# EAGLE design Insight (EAGLE 9.6.2)
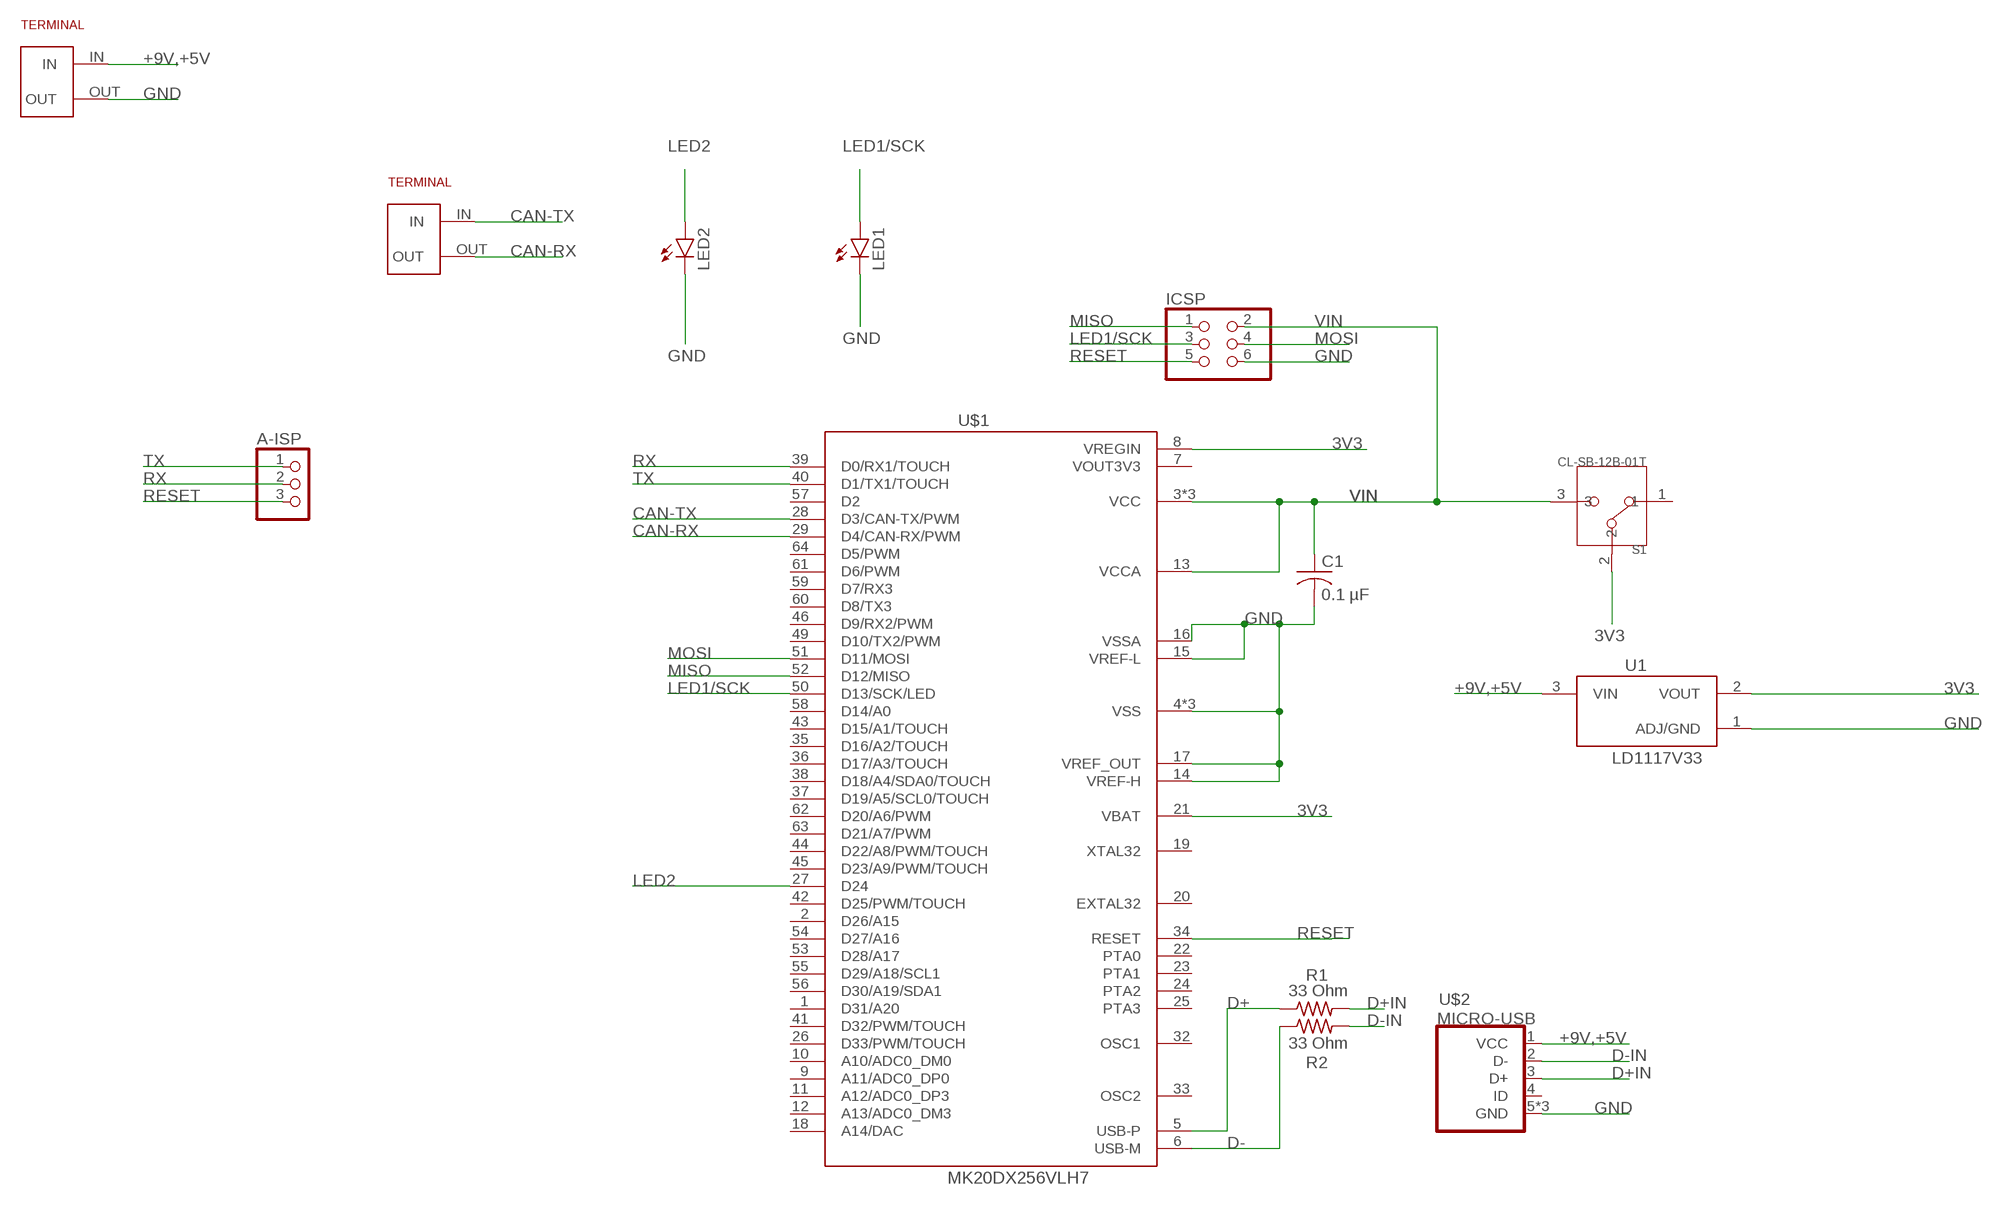
[diagram p0: schematic, sheet 1]

## Parts
A-ISP  PINHD-1X3  [1X03]
C1  0.1 µF  C-USC0805  [C0805]
ICSP  PINHD-2X3  [2X03]
LED1  LED5MM  [LED5MM]
LED2  LED5MM  [LED5MM]
R1  33 Ohm  R-US_R1206  [R1206]
R2  33 Ohm  R-US_R1206  [R1206]
S1  CL-SB-12B-01T  [CL-SB-12B]
U1  LD1117V33  [TO255P1020X450X1968-3]
U$1  MK20DX256VLH7  [QFP50P1200X1200X160-64N]
U$2  MICRO-USB  [MICRO-USB]
U$3  SCREWTERMINAL  [SCREWTERMINAL]
U$4  SCREWTERMINAL  [SCREWTERMINAL]

## Nets
3V3: S1.2 U1.2(VOUT) U$1.8(VREGIN) U$1.21(VBAT)
+9V,+5V: U1.3(VIN) U$2.1(VCC) U$3.IN
CAN-RX: U$1.29(D4/CAN-RX/PWM) U$4.OUT
CAN-TX: U$1.28(D3/CAN-TX/PWM) U$4.IN
D+: R1.1 U$1.5(USB-P)
D+IN: R1.2 U$2.3(D+)
D-: R2.1 U$1.6(USB-M)
D-IN: R2.2 U$2.2(D-)
GND: C1.2 ICSP.6 LED1.K(C) LED2.K(C) U1.1(ADJ/GND) U$1.4(VSS) U$1.14(VREF-H) U$1.15(VREF-L) U$1.16(VSSA) U$1.17(VREF_OUT) U$1.31(VSS) U$1.47(VSS) U$2.5(GND) U$2.GND1(GND) U$2.GND2(GND) U$3.OUT
LED1/SCK: ICSP.3 LED1.A U$1.50(D13/SCK/LED)
LED2: LED2.A U$1.27(D24)
MISO: ICSP.1 U$1.52(D12/MISO)
MOSI: ICSP.4 U$1.51(D11/MOSI)
RESET: A-ISP.3 ICSP.5 U$1.34(RESET)
RX: A-ISP.2 U$1.39(D0/RX1/TOUCH)
TX: A-ISP.1 U$1.40(D1/TX1/TOUCH)
VIN: C1.1 ICSP.2 S1.3 U$1.3(VCC) U$1.13(VCCA) U$1.30(VCC) U$1.48(VCC)
Unconnected: S1.1 U$1.1(D31/A20) U$1.2(D26/A15) U$1.7(VOUT3V3) U$1.9(A11/ADC0_DP0) U$1.10(A10/ADC0_DM0) U$1.11(A12/ADC0_DP3) U$1.12(A13/ADC0_DM3) U$1.18(A14/DAC) U$1.19(XTAL32) U$1.20(EXTAL32) U$1.22(PTA0) U$1.23(PTA1) U$1.24(PTA2) U$1.25(PTA3) U$1.26(D33/PWM/TOUCH) U$1.32(OSC1) U$1.33(OSC2) U$1.35(D16/A2/TOUCH) U$1.36(D17/A3/TOUCH) U$1.37(D19/A5/SCL0/TOUCH) U$1.38(D18/A4/SDA0/TOUCH) U$1.41(D32/PWM/TOUCH) U$1.42(D25/PWM/TOUCH) U$1.43(D15/A1/TOUCH) U$1.44(D22/A8/PWM/TOUCH) U$1.45(D23/A9/PWM/TOUCH) U$1.46(D9/RX2/PWM) U$1.49(D10/TX2/PWM) U$1.53(D28/A17) U$1.54(D27/A16) U$1.55(D29/A18/SCL1) U$1.56(D30/A19/SDA1) U$1.57(D2) U$1.58(D14/A0) U$1.59(D7/RX3) U$1.60(D8/TX3) U$1.61(D6/PWM) U$1.62(D20/A6/PWM) U$1.63(D21/A7/PWM) U$1.64(D5/PWM) U$2.4(ID)

## Library data of the parts
A-ISP = pinhead:PINHD-1X3: PIN HEADER
C1 = rcl:C-US: CAPACITOR, American symbol; SPICEPREFIX: C
ICSP = pinhead:PINHD-2X3: PIN HEADER
LED1 LED2 = led:LED: LED OSRAM: - CHIPLED LG R971, LG N971, LY N971, LG Q971, LY Q971, LO R971, LY R971 LH N974, LH R974 LS Q976, LO Q976, LY Q976 LO Q996 - Hyper CHIPLED LW Q18S LB Q993, LB Q99A, LB R99A - SideLED LS A670, LO A670, LY A670, LG A670, LP A670 LB A673, LV A673, LT A673, LW A673 LH A674 LY A675 LS A676, LA A676, LO A676, LY A676, LW A676 LS A679, LY A679, LG A679 - Hyper Micro SIDELED® LS Y876, LA Y876, LO Y876, LY Y876 LT Y87S - SmartLED LW L88C, LW L88S LB L89C, LB L89S, LG L890 LS L89K, LO L89K, LY L89K LS L896, LA L896, LO L896, LY L896 - TOPLED LS T670, LO T670, LY T670, LG T670, LP T670 LSG T670, LSP T670, LSY T670, LOP T670, LYG T670 LG T671, LOG T671, LSG T671 LB T673, LV T673, LT T673, LW T673 LH T674 LS T676, LA T676, LO T676, LY T676, LB T676, LH T676, LSB T676, LW T676 LB T67C, LV T67C, LT T67C, LS T67K, LO T67K, LY T67K, LW E67C LS E67B, LA E67B, LO E67B, LY E67B, LB E67C, LV E67C, LT E67C LW T67C LS T679, LY T679, LG T679 LS T770, LO T770, LY T770, LG T770, LP T770 LB T773, LV T773, LT T773, LW T773 LH T774 LS E675, LA E675, LY E675, LS T675 LS T776, LA T776, LO T776, LY T776, LB T776 LHGB T686 LT T68C, LB T68C - Hyper Mini TOPLED® LB M676 - Mini TOPLED Santana® LG M470 LS M47K, LO M47K, LY M47K Source: http://www.osram.convergy.de LUXEON: - LUMILED® LXK2-PW12-R00, LXK2-PW12-S00, LXK2-PW14-U00, LXK2-PW14-V00 LXK2-PM12-R00, LXK2-PM12-S00, LXK2-PM14-U00 LXK2-PE12-Q00, LXK2-PE12-R00, LXK2-PE12-S00, LXK2-PE14-T00, LXK2-PE14-U00 LXK2-PB12-K00, LXK2-PB12-L00, LXK2-PB12-M00, LXK2-PB14-N00, LXK2-PB14-P00, LXK2-PB14-Q00 LXK2-PR12-L00, LXK2-PR12-M00, LXK2-PR14-Q00, LXK2-PR14-R00 LXK2-PD12-Q00, LXK2-PD12-R00, LXK2-PD12-S00 LXK2-PH12-R00, LXK2-PH12-S00 LXK2-PL12-P00, LXK2-PL12-Q00, LXK2-PL12-R00 Source: www.luxeon.com KINGBRIGHT: KA-3528ASYC Source: www.kingbright.com
R1 R2 = resistor:R-US_: RESISTOR, American symbol
S1 = CL-SB-12B-01T:CL-SB-12B-01T: Check availability <https://pricing.snapeda.com/parts/CL-SB-12B-01T/Nidec%20Copal/view-part?ref=eda>; AVAILABILITY: In Stock; DESCRIPTION: Slide Switch SPDT Surface Mount; MF: Nidec Copal; MP: CL-SB-12B-01T; PACKAGE: None; PRICE: None; PURCHASE-URL: https://pricing.snapeda.com/search/part/CL-SB-12B-01T/?ref=eda
U1 = LD1117V33:LD1117V33: Check availability <https://pricing.snapeda.com/parts/LD1117V33/STMicroelectronics/view-part?ref=eda>; AVAILABILITY: In Stock; DESCRIPTION: Linear Voltage Regulator IC Positive Fixed 1 Output 800mA TO-220AB; MF: STMicroelectronics; MP: LD1117V33; PACKAGE: TO-220-3 ON Semiconductor; PRICE: None; PURCHASE-URL: https://pricing.snapeda.com/search/part/LD1117V33/?ref=eda
U$1 = MK20DX256VLH7:MK20DX256VLH7: This is a footprint for the MK20dx256VHL7, the chip at the heart of the Teensy 3.1. Notable upgrades over the Teensy 3.0 include more Flash Memory, RAM, a DAC output, additional ADC pins, etc. Remember, if you want to use USB, VOut3v3 has to be attached to the 3.3V bus. Check availability <https://pricing.snapeda.com/parts/MK20DX256VLH7/NXP%20USA/view-part?ref=eda>; AVAILABILITY: In Stock; DESCRIPTION: ARM® Cortex®-M4 Kinetis K20 Microcontroller IC 32-Bit Single-Core 72MHz 256KB (256K x 8) FLASH 64-LQFP (10x10); MF: NXP USA; MP: MK20DX256VLH7; PACKAGE: LQFP-64 NXP Semiconductors; PRICE: None; PURCHASE-URL: https://pricing.snapeda.com/search/part/MK20DX256VLH7/?ref=eda
U$2 = MicroUSB:MICRO-USB: Micro USB B connector
U$3 U$4 = screw terminal:SCREWTERMINAL

## Board
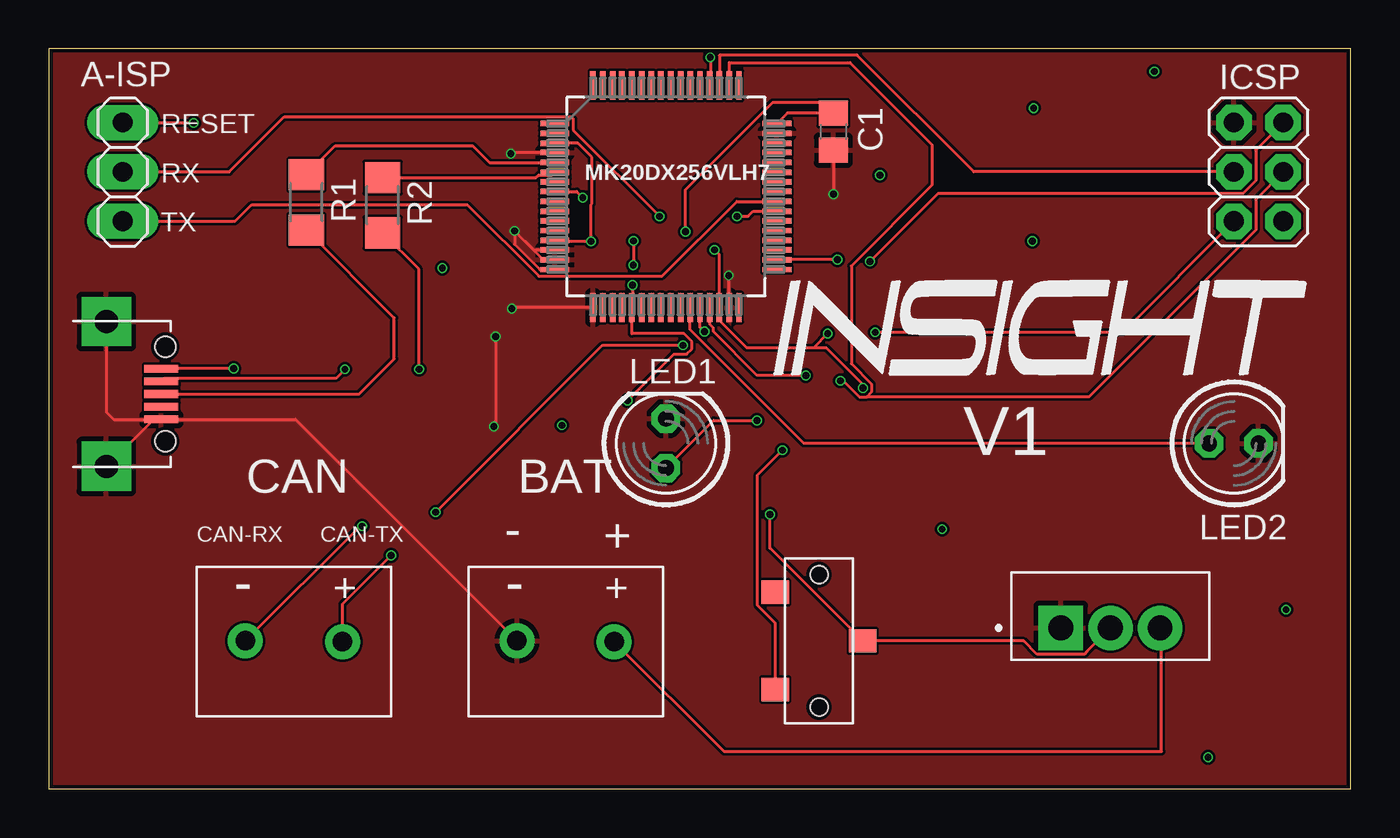
[diagram p1: board, top side]
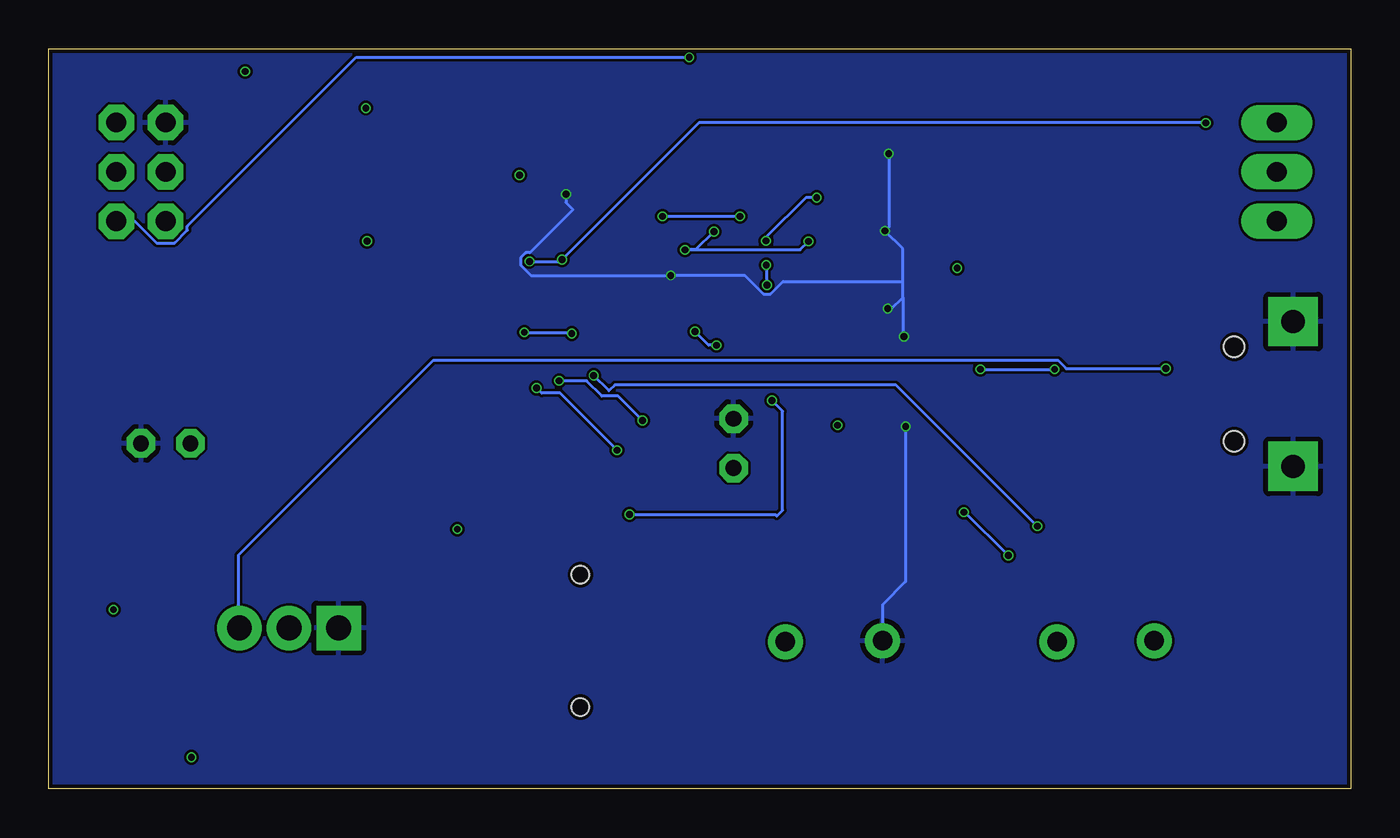
[diagram p2: board, bottom side, seen from below]

Size 66.98 x 38.09 mm. Coordinates in mm from the lower left corner, seen from the top.
Outline: 0,0 66.98,0 66.98,38.09 0,38.09 0,0
Copper layers (1*16): Top 0.035mm / dielectric 1.6mm / Bottom 0.035mm
Design rules "jlcpcb-2layers": minimum track width 5mil, minimum drill 0.3mm, track to track 5mil, track to pad 5mil, pad to pad 5mil, via to via 5mil, smd to smd 5mil, copper to edge 0.2mm, drill to drill 6mil, minimum pad ring 10mil, minimum via ring 3mil, stop-mask expansion 4mil, vias tented up to drill 0mil, thermal gap 10mil

### Footprints (pad centres in the part's own frame; a part is rotated, then mirrored left to right if it is on the bottom)
1X03 = drill 1.016 long: 1 -2.54,0; 2 0,0; 3 2.54,0
C0805 = smd 1.3 x 1.5: 1 -0.95,0; 2 0.95,0
2X03 = drill 1.016 octagon: 1 -2.54,-1.27; 2 -2.54,1.27; 3 0,-1.27; 4 0,1.27; 5 2.54,-1.27; 6 2.54,1.27
LED5MM = drill 0.813 octagon: A -1.27,0; K 1.27,0
R1206 = smd 1.6 x 1.803: 1 -1.422,0; 2 1.422,0
CL-SB-12B = smd 1.2 x 1.4: 1 -2.5,-2.25; 2 0,2.25; 3 2.5,-2.25 | hole 0.9: 3.4,0; -3.4,0
TO255P1020X450X1968-3 = drill 1.27 pad 1.91 square: 1 -2.55,-0.605 | drill 1.27 pad 1.91: 2 0,-0.605; 3 2.55,-0.605
QFP50P1200X1200X160-64N = smd 1.473 x 0.279: 1 -5.715,3.759; 2 -5.715,3.251; 3 -5.715,2.743; 4 -5.715,2.261; 5 -5.715,1.753; 6 -5.715,1.245; 7 -5.715,0.762; 8 -5.715,0.254; 9 -5.715,-0.254; 10 -5.715,-0.762; 11 -5.715,-1.245; 12 -5.715,-1.753; 13 -5.715,-2.261; 14 -5.715,-2.743; 15 -5.715,-3.251; 16 -5.715,-3.759; 33 5.715,-3.759; 34 5.715,-3.251; 35 5.715,-2.743; 36 5.715,-2.261; 37 5.715,-1.753; 38 5.715,-1.245; 39 5.715,-0.762; 40 5.715,-0.254; 41 5.715,0.254; 42 5.715,0.762; 43 5.715,1.245; 44 5.715,1.753; 45 5.715,2.261; 46 5.715,2.743; 47 5.715,3.251; 48 5.715,3.759 | smd 0.279 x 1.473: 17 -3.759,-5.715; 18 -3.251,-5.715; 19 -2.743,-5.715; 20 -2.261,-5.715; 21 -1.753,-5.715; 22 -1.245,-5.715; 23 -0.762,-5.715; 24 -0.254,-5.715; 25 0.254,-5.715; 26 0.762,-5.715; 27 1.245,-5.715; 28 1.753,-5.715; 29 2.261,-5.715; 30 2.743,-5.715; 31 3.251,-5.715; 32 3.759,-5.715; 49 3.759,5.715; 50 3.251,5.715; 51 2.743,5.715; 52 2.261,5.715; 53 1.753,5.715; 54 1.245,5.715; 55 0.762,5.715; 56 0.254,5.715; 57 -0.254,5.715; 58 -0.762,5.715; 59 -1.245,5.715; 60 -1.753,5.715; 61 -2.261,5.715; 62 -2.743,5.715; 63 -3.251,5.715; 64 -3.759,5.715
MICRO-USB = smd 0.4 x 1.75: 1 -1.3,4.525; 2 -0.65,4.525; 3 0,4.525; 4 0.65,4.525; 5 1.3,4.525 | drill 1.2 pad 2.54 square: GND1 -3.725,1.7; GND2 3.725,1.7 | hole 1.05: -2.425,4.73; 2.425,4.73
SCREWTERMINAL = drill 1 pad 1.778: IN 3.85,7.5; OUT 3.8,2.5

### Placement (x,y rotation side)
A-ISP  3.81,31.75 90 top
C1  40.36,33.82 270 top
ICSP  62.23,31.75 90 top
LED1  31.75,17.78 90 top
LED2  60.96,17.78 0 top
R1  13.26,30.18 270 top
R2  17.18,30.03 270 top
S1  39.62,7.62 270 top
U1  54.61,8.89 0 top
U$1  31.75,30.48 0 top
U$2  1.27,20.32 270 top
U$3  21.59,11.43 270 top
U$4  7.62,11.43 270 top

### Tracks (layer width: path | path; a pad name or v marks a point on that pad's centre or on a via)
3V3  (via drill 0.35)
  Top 0.152: U1.2 53.41,7.08 53.41,7.06 53.29,6.94 50.83,6.94 50.15,7.62 S1.2 37.1,12.39 v37.1,14.12 | v29.78,19.99 32.17,22.38 32.82,22.38 33.08,22.64 33.08,23.02 32.68,23.42 30,23.42 U$1.21 30.03,24.8 v30.03,25.92 | U$1.8 27.16,30.73 v27.47,30.42 | v30.08,28.19 v30.08,26.96 v30.07,26.95
  Bottom 0.152: v37.1,14.12 29.61,14.12 29.53,14.04 29.23,14.34 29.23,19.45 v29.78,19.99 | v27.47,30.42 28.04,30.42 30.08,28.38 v30.08,28.19 | v30.07,26.95 30.07,25.96 v30.03,25.92
+9V,+5V  (via drill 0.35)
  Top 0.152: U$3.IN 34.74,1.93 57.24,1.93 57.24,8.21 U1.3 | v9.52,21.63 5.8,21.63 U$2.1
  Bottom 0.152: U1.3 57.22,8.35 57.22,12.02 47.2,22.04 15.05,22.04 14.64,21.63 v9.52,21.63
CAN-RX  (via drill 0.35)
  Top 0.152: U$4.OUT 16.01,13.52 v16.13,13.52 | v38.95,21.27 36.45,21.27 34.19,23.53 34.19,23.72 34.01,23.89 U$1.29
  Bottom 0.152: v16.13,13.52 23.4,20.79 37.86,20.79 38.16,20.49 v38.95,21.27
CAN-TX  (via drill 0.35)
  Top 0.152: U$4.IN 15.12,9.52 v17.62,12.02 | v19.91,14.24 28.5,22.83 v32.63,22.83 | v33.73,23.53 33.5,23.76 U$1.28
  Bottom 0.152: v17.62,12.02 19.84,14.24 v19.91,14.24 | v32.63,22.83 33.03,22.83 v33.73,23.53
D+
  Top 0.152: R1.1 14.75,33.09 21.81,33.09 22.67,32.23 U$1.5
D+IN
  Top 0.152: U$2.3 15.97,20.32 17.78,22.13 17.78,24.24 R1.2
D-
  Top 0.152: U$1.6 25.89,31.59 25.21,31.59 25.08,31.45 R2.1
D-IN  (via drill 0.35)
  Top 0.152: U$2.2 5.95,21.13 14.78,21.13 v15.24,21.59 | R2.2 19.05,26.74 v19.05,21.59
  Bottom 0.152: v19.05,21.59 v15.24,21.59
GND  (via drill 0.35)
  Top 0.152: U$3.OUT 12.7,19.02 U$2.5 5.39,19.02 | U$2.GND2 5.39,19.02 | U$2.GND1 2.97,19.39 3.34,19.02 5.39,19.02 | U$1.17 23.88,24.77 v23.82,24.71 | v23.96,28.71 24.93,27.74 U$1.14 | v23.96,28.71 23.96,28.03 25.27,26.72 U$1.16 | v23.96,28.71 25.44,27.23 U$1.15 | U$1.4 23.82,32.74 v23.77,32.69 | U$1.31 35,26.4 v34.98,26.42 | v22.99,23.27 22.99,18.74 v22.9,18.65 | C1.2 v40.36,30.61 v40.37,30.6
  Bottom 0.152: v23.82,24.71 23.62,24.71 23.05,25.28 | 23.05,25.28 23.05,26.11 | 23.05,26.11 23.05,27.8 v23.96,28.71 23.77,28.9 v23.77,32.69 | 23.05,26.11 29.2,26.11 29.84,25.47 30.22,25.47 31.17,26.42 v34.98,26.42 42.17,26.42 42.7,26.95 42.7,27.33 42.44,27.59 42.23,27.59 40.01,29.81 40.37,30.17 v40.37,30.6 | 23.05,25.28 23.05,23.33 v22.99,23.27 | v22.9,18.65 22.9,10.67 24.09,9.48 U$3.OUT
  pour Top: -2.54,40.64 69.85,40.64 69.85,-2.54 -1.27,-2.54 -2.54,-1.27
  pour Bottom: -7.62,44.45 74.93,44.45 74.93,-5.08 -8.89,-5.08 -8.89,44.45
LED1/SCK  (via drill 0.35)
  Top 0.152: LED1.A 34.2,18.96 v36.43,18.96 | 42.08,20.18 41.7,20.18 40.88,21 v40.72,21 | 42.08,20.18 42.34,20.44 42.34,20.82 41.28,21.88 41.28,26.91 45.43,31.06 45.43,33.16 41.22,37.37 35,37.37 U$1.50 | ICSP.3 62.08,30.33 62.08,28.75 53.51,20.18 42.08,20.18
  Bottom 0.152: v40.72,21 39.31,21 38.52,20.21 37.68,20.21 v36.43,18.96
LED2
  Top 0.152: LED2.A 38.84,17.78 32.99,23.62 U$1.27
MISO  (via drill 0.35)
  Top 0.152: v34.03,37.64 34.03,36.21 U$1.52
  Bottom 0.152: ICSP.1 62.54,29.21 61.42,28.09 60.5,28.09 59.84,28.75 59.84,28.95 51.15,37.64 v34.03,37.64
MOSI
  Top 0.152: ICSP.4 47.59,31.75 41.58,37.76 34.51,37.76 34.49,37.74 U$1.51
N$2  (via drill 0.35)
  other vias: 20.25,26.8
N$6  (via drill 0.35)
  other vias: 26.4,18.71
N$8  (via drill 0.35)
  other vias: 45.96,13.37
N$9  (via drill 0.35)
  other vias: 50.6,28.19
N$11  (via drill 0.35)
  other vias: 50.66,35.03
N$12  (via drill 0.35)
  other vias: 42.76,31.58
N$14  (via drill 0.35)
  other vias: 56.87,36.91
N$17  (via drill 0.35)
  other vias: 63.64,9.23
N$19  (via drill 0.35)
  other vias: 59.63,1.63
RESET  (via drill 0.35)
  Top 0.152: A-ISP.3 7.44,34.29 v7.46,34.27 | v40.57,27.23 U$1.34 | ICSP.5 62.08,32.87 62.08,31.29 61.42,30.63 45.74,30.63 v42.25,27.14
  Bottom 0.152: v7.46,34.27 33.53,34.27 v40.57,27.23 40.66,27.14 v42.25,27.14
RX  (via drill 0.35)
  Top 0.152: A-ISP.2 9.29,31.75 12.12,34.58 26.86,34.58 26.98,34.46 26.98,33.91 v31.42,29.46 | v35.4,29.46 35.98,29.46 36.24,29.72 U$1.39
  Bottom 0.152: v35.4,29.46 v31.42,29.46
TX
  Top 0.152: A-ISP.1 9.59,29.21 10.44,30.06 21.53,30.06 25.21,26.38 31.55,26.38 35.4,30.23 U$1.40
VIN  (via drill 0.35)
  Top 0.152: S1.3 37.37,8.53 36.47,9.44 36.47,16.16 v37.74,17.43 | v41.89,20.63 41.89,20.8 40,22.69 39.33,22.69 | 39.33,22.69 35.91,22.69 34.49,24.11 U$1.30 34.49,27.5 v34.25,27.74 | U$1.13 26.08,28.17 v27.9,28.17 27.9,30.07 27.95,30.12 27.95,32.5 27.23,33.22 U$1.3 | ICSP.2 55.24,23.49 v42.51,23.49 | v40.07,23.43 39.33,22.69 | v32.76,28.68 32.76,30.84 37.25,35.33 39.8,35.33 C1.1 38,34.77 U$1.48
  Bottom 0.152: v37.74,17.43 40.67,20.36 41.62,20.36 v41.89,20.63 | v27.9,28.17 28.33,27.74 v34.25,27.74 33.7,27.74 v32.76,28.68 | v42.51,23.49 40.13,23.49 v40.07,23.43

### Text on the board
tNames: RESET | RX | TX | V1 | CAN | BAT | CAN-RX | CAN-TX | - | +